# EAGLE design CET_GPS_5_03_22 (EAGLE 9.6.2)
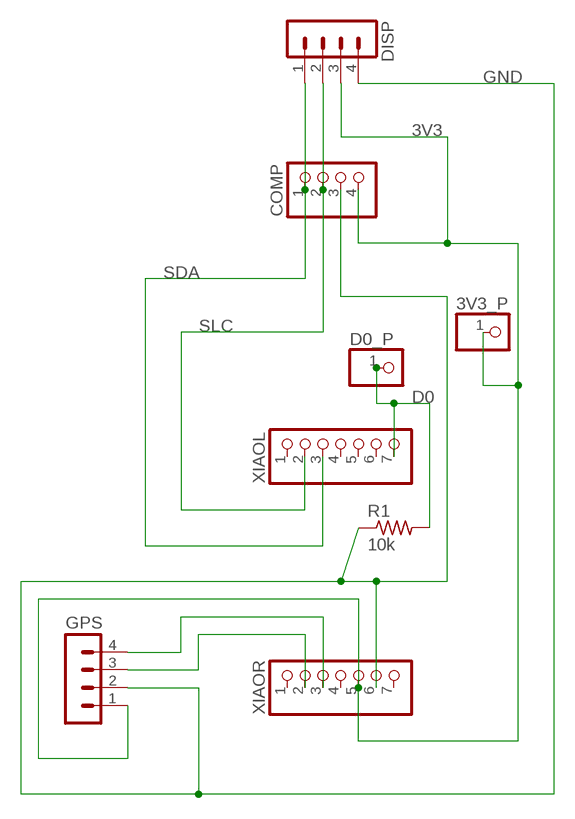
[diagram p0: schematic, sheet 1]

## Parts
3V3_P  PINHD-1X1  [1X01]
COMP  PINHD-1X4/90  [1X04/90]
D0_P  PINHD-1X1  [1X01]
DISP  MA04-1  [MA04-1]
GPS  MA04-1  [MA04-1]
R1  10k  R-US_0204/7  [0204/7]
XIAOL  PINHD-1X7  [1X07]
XIAOR  PINHD-1X7  [1X07]

## Nets
3V3: 3V3_P.1 COMP.4 DISP.3 GPS.1 XIAOR.5
D0: D0_P.1 R1.2 XIAOL.7
GND: COMP.3 DISP.4 GPS.2 R1.1 XIAOR.6
RX: GPS.3 XIAOR.2
SDA: COMP.1 DISP.1 XIAOL.3
SLC: COMP.2 DISP.2 XIAOL.2
TX: GPS.4 XIAOR.3
Unconnected: XIAOL.1 XIAOL.4 XIAOL.5 XIAOL.6 XIAOR.1 XIAOR.4 XIAOR.7

## Library data of the parts
3V3_P D0_P = pinhead:PINHD-1X1: PIN HEADER
COMP = pinhead:PINHD-1X4: PIN HEADER
DISP GPS = con-lstb:MA04-1: PIN HEADER; OC_FARNELL: unknown; OC_NEWARK: unknown
R1 = rcl:R-US_: RESISTOR, American symbol; SPICEPREFIX: R
XIAOL XIAOR = pinhead:PINHD-1X7: PIN HEADER

## Board
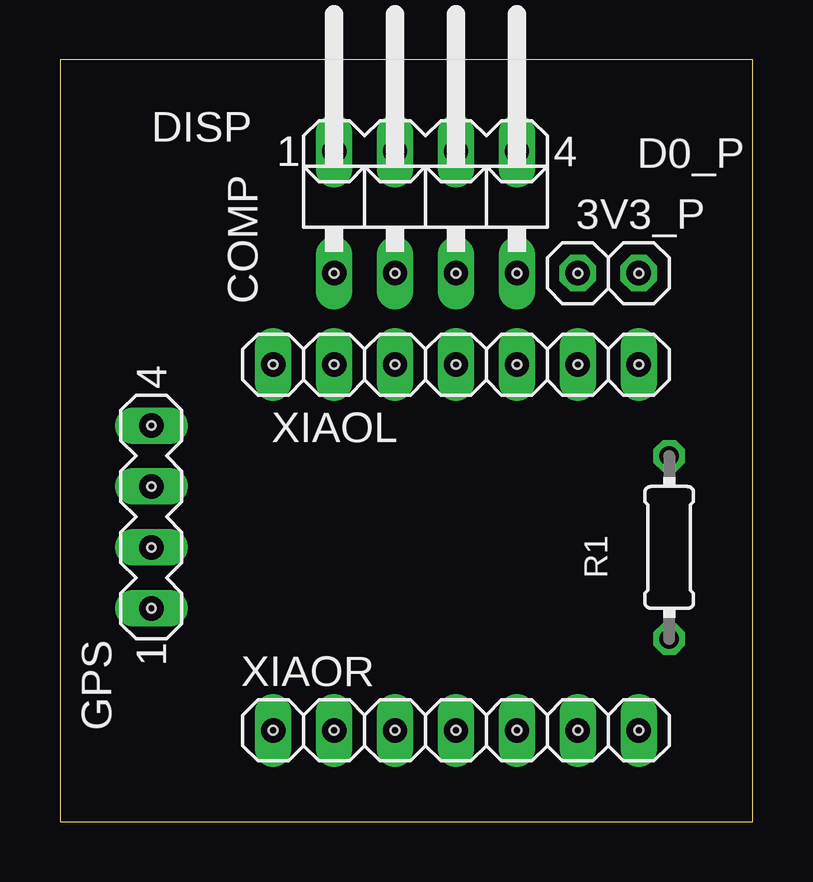
[diagram p1: board, top side]
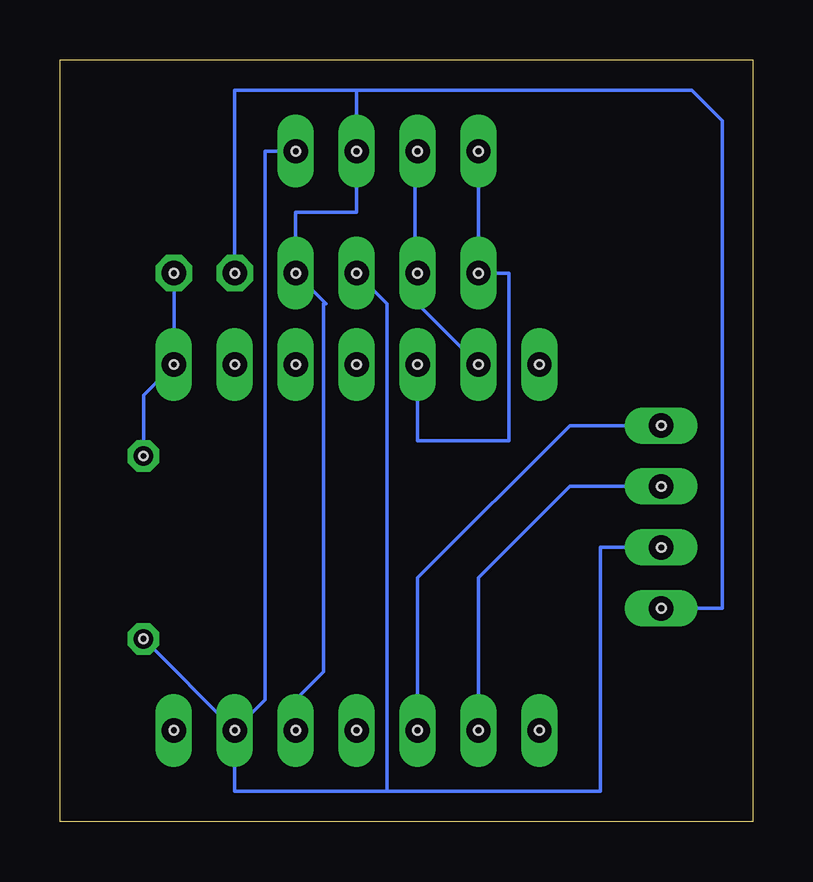
[diagram p2: board, bottom side, seen from below]

Size 28.88 x 31.74 mm. Coordinates in mm from the lower left corner, seen from the top.
Outline: 0,0 28.88,0 28.88,31.74 0,31.74 0,0
Copper layers (1*16): Top 0.035mm / dielectric 1.5mm / Bottom 0.035mm
Design rules "default": minimum track width 6mil, minimum drill 0.35mm, track to track 6mil, track to pad 6mil, pad to pad 6mil, via to via 6mil, smd to smd 6mil, copper to edge 40mil, drill to drill 6mil, minimum pad ring 10mil, minimum via ring 8mil, stop-mask expansion 4mil, vias tented up to drill 0mil, thermal gap 10mil
Holes 0.35 mm at 24.13,22.86 25.4,15.24 25.4,7.62 19.05,22.86 16.51,22.86 13.97,22.86 11.43,22.86 11.43,27.94 13.97,27.94 16.51,27.94 19.05,27.94 8.89,19.05 11.43,19.05 13.97,19.05 16.51,19.05 19.05,19.05 21.59,19.05 24.13,19.05 8.89,3.81 11.43,3.81 13.97,3.81 16.51,3.81 19.05,3.81 21.59,3.81 24.13,3.81 21.59,22.86 3.81,16.51 3.81,13.97 3.81,11.43 3.81,8.89

### Footprints (pad centres in the part's own frame; a part is rotated, then mirrored left to right if it is on the bottom)
1X01 = drill 1.016 octagon: 1 0,0
1X04/90 = drill 1.016 long: 1 -3.81,-3.81; 2 -1.27,-3.81; 3 1.27,-3.81; 4 3.81,-3.81
MA04-1 = drill 1.016 long: 1 -3.81,0; 2 -1.27,0; 3 1.27,0; 4 3.81,0
0204/7 = drill 0.813 octagon: 1 -3.81,0; 2 3.81,0
1X07 = drill 1.016 long: 1 -7.62,0; 2 -5.08,0; 3 -2.54,0; 4 0,0; 5 2.54,0; 6 5.08,0; 7 7.62,0

### Placement (x,y rotation side)
3V3_P  21.59,22.86 0 top
COMP  15.24,26.67 0 top
D0_P  24.13,22.86 0 top
DISP  15.24,27.94 0 top
GPS  3.81,12.7 90 top
R1  25.4,11.43 90 top
XIAOL  16.51,19.05 0 top
XIAOR  16.51,3.81 0 top

### Tracks (layer width: path | path; a pad name or v marks a point on that pad's centre or on a via)
3V3  (1 unrouted)
  Bottom 0.152: XIAOR.5 19.05,5.08 17.88,6.25 17.88,21.59 17.78,21.59 COMP.4 | 3V3_P.1 21.59,30.48 16.51,30.48 | 16.51,30.48 DISP.3 16.51,25.4 19.05,25.4 COMP.4 | 16.51,30.48 2.54,30.48 1.27,29.21 1.27,8.89 GPS.1
D0
  Bottom 0.152: R1.2 25.4,17.78 XIAOL.7 D0_P.1
GND
  Bottom 0.152: DISP.4 20.32,27.94 20.32,5.08 XIAOR.6 | 15.24,1.27 21.59,1.27 XIAOR.6 | 15.24,1.27 15.24,21.59 COMP.3 | R1.1 XIAOR.6 | GPS.2 6.35,11.43 6.35,1.27 15.24,1.27
RX
  Bottom 0.152: GPS.3 7.62,13.97 11.43,10.16 XIAOR.2
SDA
  Bottom 0.152: DISP.1 COMP.1 10.16,22.86 10.16,15.88 13.97,15.88 XIAOL.3
SLC
  Bottom 0.152: XIAOL.2 14.07,21.69 14.07,22.86 | 14.07,22.86 14.07,27.89 DISP.2 | 14.07,22.86 COMP.2
TX
  Bottom 0.152: GPS.4 7.62,16.51 13.97,10.16 13.97,5.08 | 13.97,5.08 | XIAOR.3 13.97,5.08